# Altium project 404_Senior_Design_Maria.PrjPcb
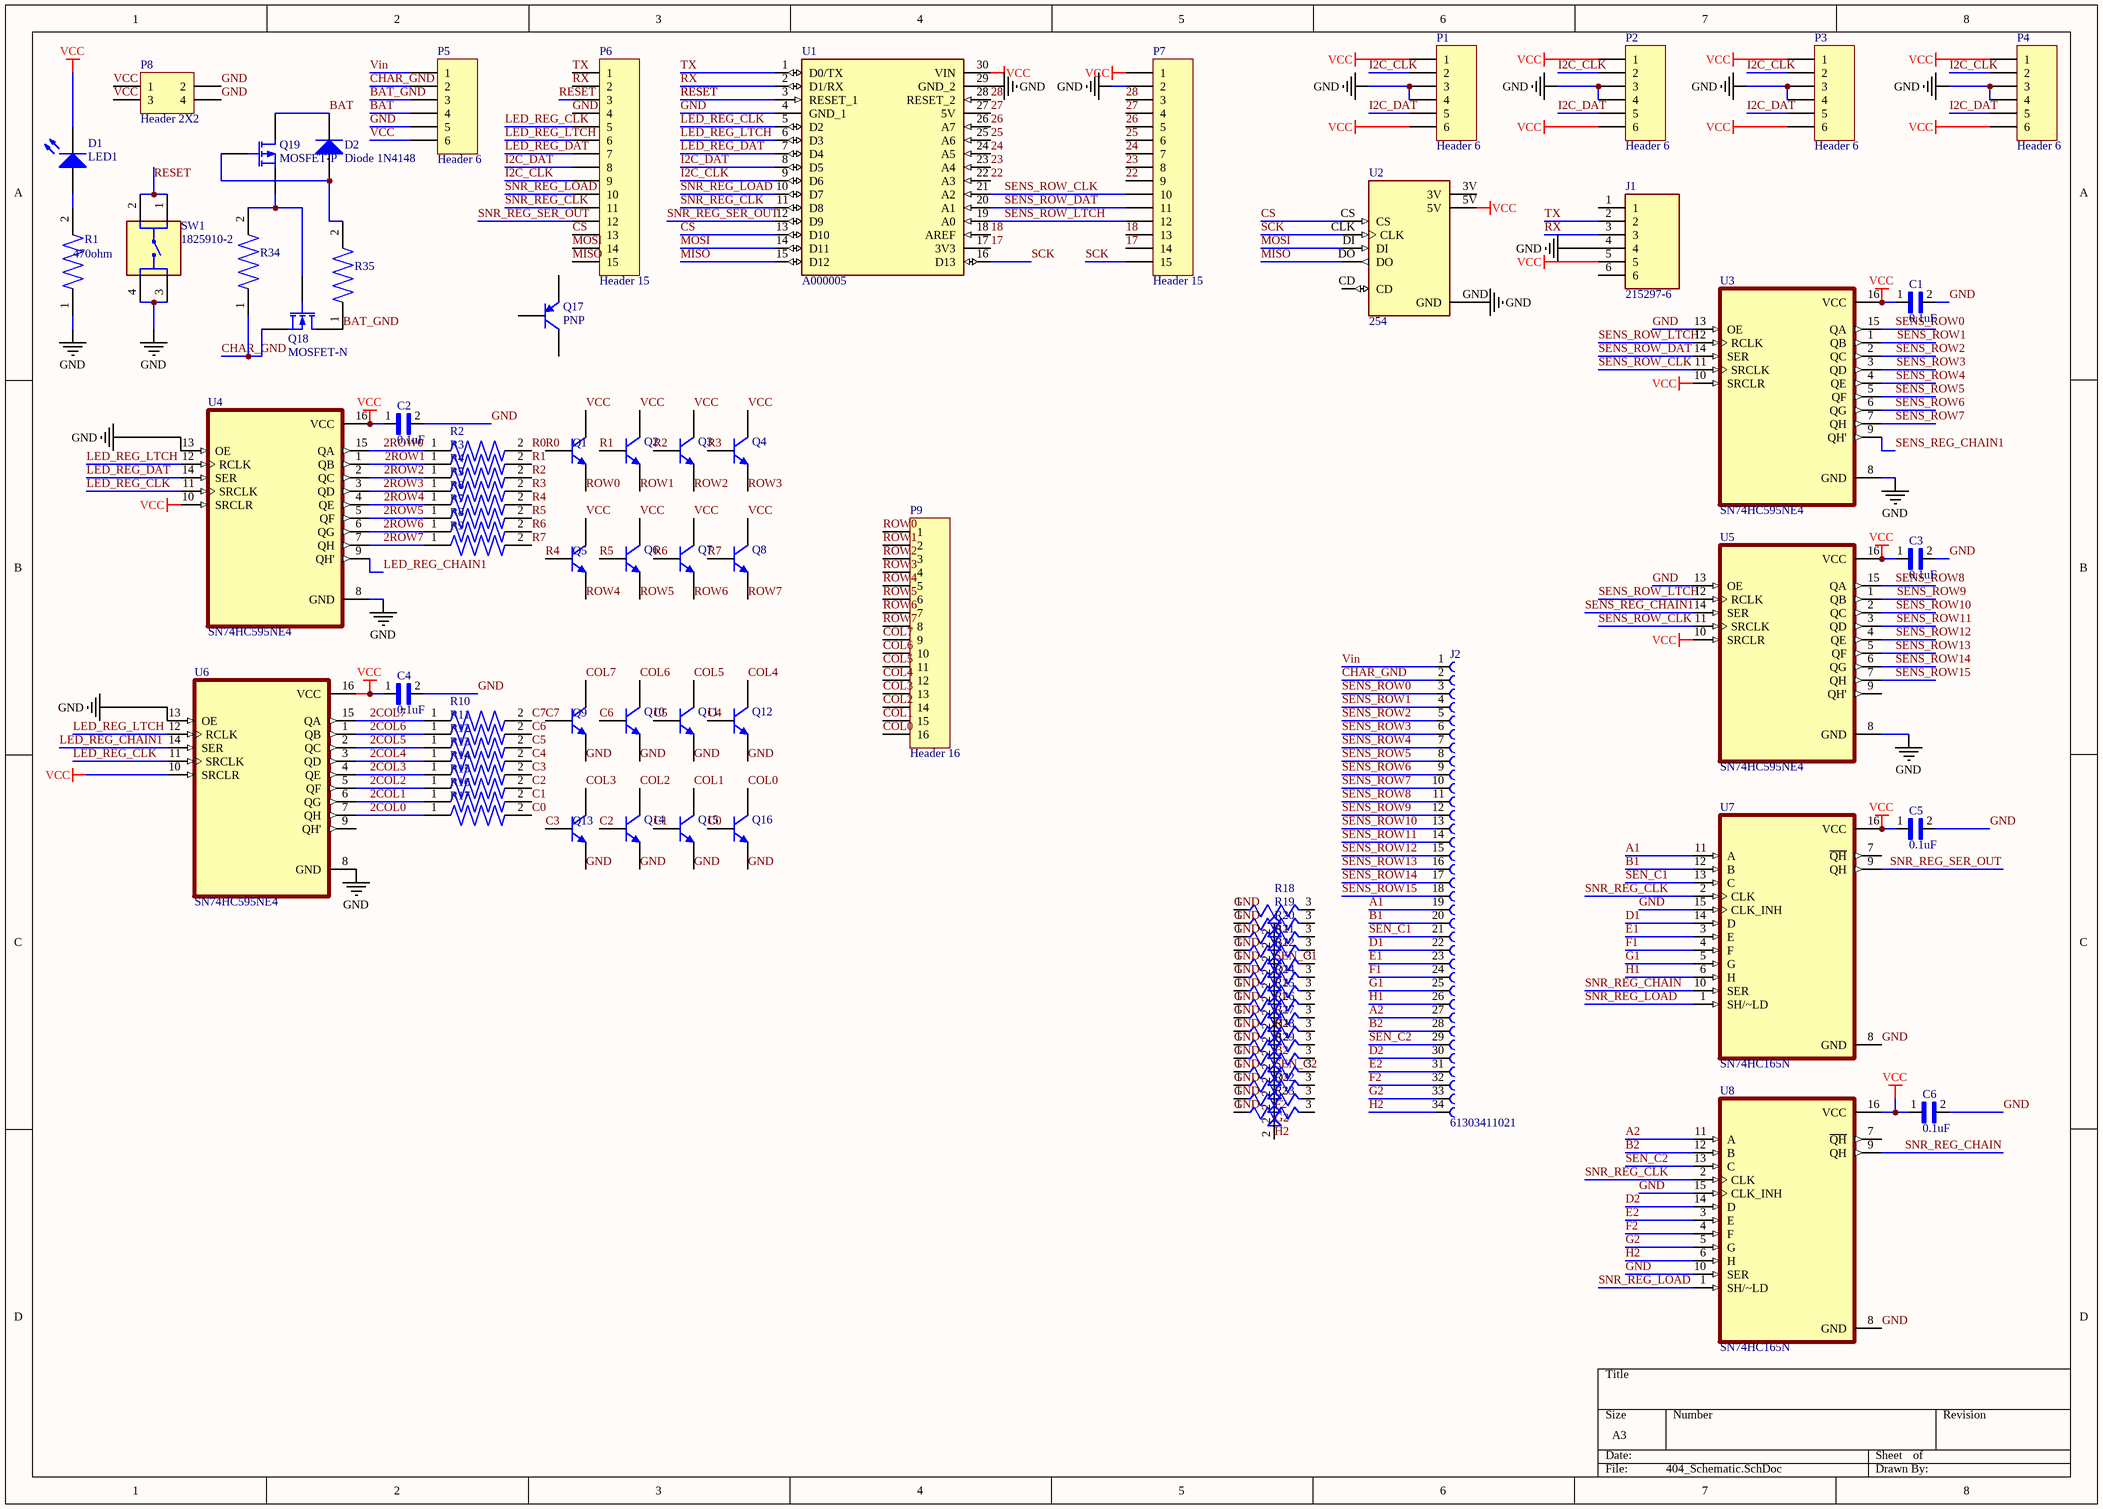
[diagram p0: 404_Schematic.SchDoc]
1 sheet, 82 parts. Net scope: global (net labels, ports and power ports of the same name join across sheets).
Board file: 404_PCB.PcbDoc

## Sheet 404_Schematic.SchDoc
size A3; SheetNumber: 1; SheetTotal: 1

### Parts
C1  0.1uF  [CAP_RDER72H103K1K1H03B]
C2  0.1uF  [CAP_RDER72H103K1K1H03B]
C3  0.1uF  [CAP_RDER72H103K1K1H03B]
C4  0.1uF  [CAP_RDER72H103K1K1H03B]
C5  0.1uF  [CAP_RDER72H103K1K1H03B]
C6  0.1uF  [CAP_RDER72H103K1K1H03B]
D1  LED1  [LED-1]
D2  Diode 1N4148  [DO-35]
J1  215297-6  [TE_215297-6]
J2  61303411021  [61303411021]
P1  Header 6  [HDR1X6]
P2  Header 6  [HDR1X6]
P3  Header 6  [HDR1X6]
P4  Header 6  [HDR1X6]
P5  Header 6  [HDR1X6]
P6  Header 15  [HDR1X15]
P7  Header 15  [HDR1X15]
P8  Header 2X2  [HDR2X2]
P9  Header 16  [HDR1X16]
Q1  2N3904  [TO-92A]  (value not drawn)
Q2  2N3904  [TO-92A]  (value not drawn)
Q3  2N3904  [TO-92A]  (value not drawn)
Q4  2N3904  [TO-92A]  (value not drawn)
Q5  2N3904  [TO-92A]  (value not drawn)
Q6  2N3904  [TO-92A]  (value not drawn)
Q7  2N3904  [TO-92A]  (value not drawn)
Q8  2N3904  [TO-92A]  (value not drawn)
Q9  2N3904  [TO-92A]  (value not drawn)
Q10  2N3904  [TO-92A]  (value not drawn)
Q11  2N3904  [TO-92A]  (value not drawn)
Q12  2N3904  [TO-92A]  (value not drawn)
Q13  2N3904  [TO-92A]  (value not drawn)
Q14  2N3904  [TO-92A]  (value not drawn)
Q15  2N3904  [TO-92A]  (value not drawn)
Q16  2N3904  [TO-92A]  (value not drawn)
Q17  PNP  [SOT-23B_N]
Q18  MOSFET-N  [E3]
Q19  MOSFET-P  [E3]
R1  470ohm  [RESAD700W45L350D185]
R2  390  [RESAD700W45L350D185]  (value not drawn)
R3  390  [RESAD700W45L350D185]  (value not drawn)
R4  390  [RESAD700W45L350D185]  (value not drawn)
R5  (no value)  [RESAD700W45L350D185]
R6  1-1623928-1  [RESAD700W45L350D185]  (value not drawn)
R7  1-1623928-1  [RESAD700W45L350D185]  (value not drawn)
R8  1-1623928-1  [RESAD700W45L350D185]  (value not drawn)
R9  1-1623928-1  [RESAD700W45L350D185]  (value not drawn)
R10  390  [RESAD700W45L350D185]  (value not drawn)
R11  390  [RESAD700W45L350D185]  (value not drawn)
R12  390  [RESAD700W45L350D185]  (value not drawn)
R13  (no value)  [RESAD700W45L350D185]
R14  1-1623928-1  [RESAD700W45L350D185]  (value not drawn)
R15  1-1623928-1  [RESAD700W45L350D185]  (value not drawn)
R16  1-1623928-1  [RESAD700W45L350D185]  (value not drawn)
R17  1-1623928-1  [RESAD700W45L350D185]  (value not drawn)
R18  3352T-1-103LF  [TRIM_3352T-1-103LF]  (value not drawn)
R19  3352T-1-103LF  [TRIM_3352T-1-103LF]  (value not drawn)
R20  3352T-1-103LF  [TRIM_3352T-1-103LF]  (value not drawn)
R21  3352T-1-103LF  [TRIM_3352T-1-103LF]  (value not drawn)
R22  3352T-1-103LF  [TRIM_3352T-1-103LF]  (value not drawn)
R23  3352T-1-103LF  [TRIM_3352T-1-103LF]  (value not drawn)
R24  3352T-1-103LF  [TRIM_3352T-1-103LF]  (value not drawn)
R25  3352T-1-103LF  [TRIM_3352T-1-103LF]  (value not drawn)
R26  3352T-1-103LF  [TRIM_3352T-1-103LF]  (value not drawn)
R27  3352T-1-103LF  [TRIM_3352T-1-103LF]  (value not drawn)
R28  3352T-1-103LF  [TRIM_3352T-1-103LF]  (value not drawn)
R29  3352T-1-103LF  [TRIM_3352T-1-103LF]  (value not drawn)
R30  3352T-1-103LF  [TRIM_3352T-1-103LF]  (value not drawn)
R31  3352T-1-103LF  [TRIM_3352T-1-103LF]  (value not drawn)
R32  3352T-1-103LF  [TRIM_3352T-1-103LF]  (value not drawn)
R33  3352T-1-103LF  [TRIM_3352T-1-103LF]  (value not drawn)
R34  390  [RESAD700W45L350D185]  (value not drawn)
R35  390  [RESAD700W45L350D185]  (value not drawn)
SW1  1825910-2  [TE_1825910-2]
U1  A000005  [MODULE_A000005]
U2  254  [MODULE_254]
U3  SN74HC595NE4  [DIP794W45P254L1969H508Q16]
U4  SN74HC595NE4  [DIP794W45P254L1969H508Q16]
U5  SN74HC595NE4  [DIP794W45P254L1969H508Q16]
U6  SN74HC595NE4  [DIP794W45P254L1969H508Q16]
U7  SN74HC165N  [DIP794W45P254L1969H508Q16]
U8  SN74HC165N  [DIP794W45P254L1969H508Q16]

### Nets
GND: C1.2 C2.2 C3.2 C4.2 C5.2 C6.2 J1.4 P1.3 P1.4 P2.3 P2.4 P3.3 P3.4 P4.3 P4.4 P5.5 P6.4 P7.2 P8.2 P8.4 Q9.1(E) Q10.1(E) Q11.1(E) Q12.1(E) Q13.1(E) Q14.1(E) Q15.1(E) Q16.1(E) R1.1 R18.1(CCW) R19.1(CCW) R20.1(CCW) R21.1(CCW) R22.1(CCW) R23.1(CCW) R24.1(CCW) R25.1(CCW) R26.1(CCW) R27.1(CCW) R28.1(CCW) R29.1(CCW) R30.1(CCW) R31.1(CCW) R32.1(CCW) R33.1(CCW) SW1.3 SW1.4 U1.4(GND_1) U1.29(GND_2) U2.GND U3.8(GND) U3.13(OE) U4.8(GND) U4.13(OE) U5.8(GND) U5.13(OE) U6.8(GND) U6.13(OE) U7.8(GND) U7.15(CLK_INH) U8.8(GND) U8.10(SER) U8.15(CLK_INH)
VCC: C1.1 C2.1 C3.1 C4.1 C5.1 C6.1 D1.2(K) J1.5 P1.1 P1.6 P2.1 P2.6 P3.1 P3.6 P4.1 P4.6 P5.6 P7.1 P8.1 P8.3 Q1.3(C) Q2.3(C) Q3.3(C) Q4.3(C) Q5.3(C) Q6.3(C) Q7.3(C) Q8.3(C) U1.30(VIN) U2.5V U3.10(SRCLR) U3.16(VCC) U4.10(SRCLR) U4.16(VCC) U5.10(SRCLR) U5.16(VCC) U6.10(SRCLR) U6.16(VCC) U7.16(VCC) U8.16(VCC)
2COL0: R17.1 U6.7(QH)
2COL1: R16.1 U6.6(QG)
2COL2: R15.1 U6.5(QF)
2COL3: R14.1 U6.4(QE)
2COL4: R13.1 U6.3(QD)
2COL5: R12.1 U6.2(QC)
2COL6: R11.1 U6.1(QB)
2COL7: R10.1 U6.15(QA)
2ROW0: R2.1 U4.15(QA)
2ROW1: R3.1 U4.1(QB)
2ROW2: R4.1 U4.2(QC)
2ROW3: R5.1 U4.3(QD)
2ROW4: R6.1 U4.4(QE)
2ROW5: R7.1 U4.5(QF)
2ROW6: R8.1 U4.6(QG)
2ROW7: R9.1 U4.7(QH)
17: P7.14 U1.17(3V3)
18: P7.13 U1.18(AREF)
22: P7.9 U1.22(A3)
23: P7.8 U1.23(A4)
24: P7.7 U1.24(A5)
25: P7.6 U1.25(A6)
26: P7.5 U1.26(A7)
27: P7.4 U1.27(5V)
28: P7.3 U1.28(RESET_2)
A1: J2.19 R18.2(WIPER) U7.11(A)
A2: J2.27 R26.2(WIPER) U8.11(A)
B1: J2.20 R19.2(WIPER) U7.12(B)
B2: J2.28 R27.2(WIPER) U8.12(B)
BAT: D2.2(K) P5.4 Q19.1(D)
BAT_GND: P5.3 Q18.1(D) R35.1
C0: Q16.2(B) R17.2
C1: Q15.2(B) R16.2
C2: Q14.2(B) R15.2
C3: Q13.2(B) R14.2
C4: Q12.2(B) R13.2
C5: Q11.2(B) R12.2
C6: Q10.2(B) R11.2
C7: Q9.2(B) R10.2
CHAR_GND: J2.2 P5.2 Q18.3(S) R34.1
COL0: P9.16 Q16.3(C)
COL1: P9.15 Q15.3(C)
COL2: P9.14 Q14.3(C)
COL3: P9.13 Q13.3(C)
COL4: P9.12 Q12.3(C)
COL5: P9.11 Q11.3(C)
COL6: P9.10 Q10.3(C)
COL7: P9.9 Q9.3(C)
CS: P6.13 U1.13(D10) U2.CS
D1: J2.22 R21.2(WIPER) U7.14(D)
D2: J2.30 R29.2(WIPER) U8.14(D)
E1: J2.23 R22.2(WIPER) U7.3(E)
E2: J2.31 R30.2(WIPER) U8.3(E)
F1: J2.24 R23.2(WIPER) U7.4(F)
F2: J2.32 R31.2(WIPER) U8.4(F)
G1: J2.25 R24.2(WIPER) U7.5(G)
G2: J2.33 R32.2(WIPER) U8.5(G)
H1: J2.26 R25.2(WIPER) U7.6(H)
H2: J2.34 R33.2(WIPER) U8.6(H)
I2C_CLK: P1.2 P2.2 P3.2 P4.2 P6.9 U1.9(D6)
I2C_DAT: P1.5 P2.5 P3.5 P4.5 P6.8 U1.8(D5)
LED_REG_CHAIN1: U4.9(QH') U6.14(SER)
LED_REG_CLK: P6.5 U1.5(D2) U4.11(SRCLK) U6.11(SRCLK)
LED_REG_DAT: P6.7 U1.7(D4) U4.14(SER)
LED_REG_LTCH: P6.6 U1.6(D3) U4.12(RCLK) U6.12(RCLK)
MISO: P6.15 U1.15(D12) U2.DO
MOSI: P6.14 U1.14(D11) U2.DI
R0: Q1.2(B) R2.2
R1: Q2.2(B) R3.2
R2: Q3.2(B) R4.2
R3: Q4.2(B) R5.2
R4: Q5.2(B) R6.2
R5: Q6.2(B) R7.2
R6: Q7.2(B) R8.2
R7: Q8.2(B) R9.2
RESET: P6.3 SW1.1 SW1.2 U1.3(RESET_1)
ROW0: P9.1 Q1.1(E)
ROW1: P9.2 Q2.1(E)
ROW2: P9.3 Q3.1(E)
ROW3: P9.4 Q4.1(E)
ROW4: P9.5 Q5.1(E)
ROW5: P9.6 Q6.1(E)
ROW6: P9.7 Q7.1(E)
ROW7: P9.8 Q8.1(E)
RX: J1.3 P6.2 U1.2(D1/RX)
SCK: P7.15 U1.16(D13) U2.CLK
SEN_C1: J2.21 R20.2(WIPER) U7.13(C)
SEN_C2: J2.29 R28.2(WIPER) U8.13(C)
SENS_REG_CHAIN1: U3.9(QH') U5.14(SER)
SENS_ROW0: J2.3 U3.15(QA)
SENS_ROW1: J2.4 U3.1(QB)
SENS_ROW2: J2.5 U3.2(QC)
SENS_ROW3: J2.6 U3.3(QD)
SENS_ROW4: J2.7 U3.4(QE)
SENS_ROW5: J2.8 U3.5(QF)
SENS_ROW6: J2.9 U3.6(QG)
SENS_ROW7: J2.10 U3.7(QH)
SENS_ROW8: J2.11 U5.15(QA)
SENS_ROW9: J2.12 U5.1(QB)
SENS_ROW10: J2.13 U5.2(QC)
SENS_ROW11: J2.14 U5.3(QD)
SENS_ROW12: J2.15 U5.4(QE)
SENS_ROW13: J2.16 U5.5(QF)
SENS_ROW14: J2.17 U5.6(QG)
SENS_ROW15: J2.18 U5.7(QH)
SENS_ROW_CLK: P7.10 U1.21(A2) U3.11(SRCLK) U5.11(SRCLK)
SENS_ROW_DAT: P7.11 U1.20(A1) U3.14(SER)
SENS_ROW_LTCH: P7.12 U1.19(A0) U3.12(RCLK) U5.12(RCLK)
SNR_REG_CHAIN: U7.10(SER) U8.9(QH)
SNR_REG_CLK: P6.11 U1.11(D8) U7.2(CLK) U8.2(CLK)
SNR_REG_LOAD: P6.10 U1.10(D7) U7.1(SH/~LD) U8.1(SH/~LD)
SNR_REG_SER_OUT: P6.12 U1.12(D9) U7.9(QH)
TX: J1.2 P6.1 U1.1(D0/TX)
Vin: J2.1 P5.1
NetD1_1: D1.1(A) R1.2
NetD2_1: D2.1(A) Q19.2(G) R35.2
NetQ18_2: Q18.2(G) Q19.3(S) R34.2

Not connected (* = marked no-connect by the designer): J1 1 6; Q17 1(C) 2(B) 3(E); R18 3(CW); R19 3(CW); R20 3(CW); R21 3(CW); R22 3(CW); R23 3(CW); R24 3(CW); R25 3(CW); R26 3(CW); R27 3(CW); R28 3(CW); R29 3(CW); R30 3(CW); R31 3(CW); R32 3(CW); R33 3(CW); U2 3V CD; U5 9(QH'); U6 9(QH'); U7 7(~{QH}); U8 7(~{QH})

### Library data of the parts
C1-C6 = RDER72H103K1K1H03B: Cap Ceramic 0.0047uF 50V C0G 5% Radial 5mm 125C Bulk; MF: {'manufacturer': u'Murata'}; Package: None; Availability: Unavailable; Value: *; MP: RDER72H103K1K1H03B; Price: None
D1 = LED1: Typical RED GaAs LED; Published: 8-Jun-2000; LatestRevisionDate: 08-Jul-2005; LatestRevisionNote: Mech Layer 1 removed.; PackageReference: LED-1; Publisher: Altium Limited; PackageDescription: LED; 2 Leads
D2 = Diode 1N4148: High Conductance Fast Diode; Published: 8-Jun-2000; LatestRevisionDate: 17-Jul-2002; LatestRevisionNote: Re-released for DXP Platform.; DatasheetVersion: 1997; PackageReference: DO-35; Publisher: Altium Limited; PackageDescription: Diode, Axial; Body 3.8 x 1.9 mm (LxDia. max), Lead Dia. 0.53 mm (max); Code_JEDEC: DO-204-AH; ComponentLink1Description: Manufacturer Link; ComponentLink1URL: http://www.fairchildsemi.com/; ComponentLink2Description: Datasheet; ComponentLink2URL: http://www.fairchildsemi.com/ds/1N%2F1N4148.pdf
J1 = 215297-6: MF: {'manufacturer': u'TE Connectivity'}; Value: *; Availability: Unavailable; Package: None; MP: 215297-6; Price: None
J2 = 61303411021: <b> WR-PHD 2.54mm Angled Pin Header, 34 Pins/<b>=>Con_BTB_PHD_2.54_1_THT_61303411021 <br><a href="http://katalog.we-online.de/media/images/eican/Con_BTB_PHD_2.54_1_THT_61303211021_pf2.jpg" title="Enlarge picture"> <img src="http://katalog.we-online.de/media/thumbs2/eican/thb_Con_BTB_PHD_2.54_1_THT_61303211021_pf2.jpg" width="320"></a><p> Details see: <a href="http://katalog.we-online.de/en/em/613_0xx_110_21">http://katalog.we-online.de/en/em/613_0xx_110_21</a><p> Created 2014-05-29, Karrer Zheng<br> 2014 (C) WÃ¼rth Elektronik; MF: {'manufacturer': u'W\xfcrth Elektronik'}; Value: *; MP: 61303411021; Package: None; Availability: Unavailable; Price: None
P1-P5 = Header 6: Header, 6-Pin; LatestRevisionDate: 17-Jul-2002; LatestRevisionNote: Re-released for DXP Platform.; Publisher: Altium Limited
P6 P7 = Header 15: Header, 15-Pin; LatestRevisionDate: 17-Jul-2002; LatestRevisionNote: Re-released for DXP Platform.; Publisher: Altium Limited
P8 = Header 2X2: Header, 2-Pin, Dual row; LatestRevisionDate: 17-Jul-2002; LatestRevisionNote: Re-released for DXP Platform.; Publisher: Altium Limited
P9 = Header 16: Header, 16-Pin; LatestRevisionDate: 17-Jul-2002; LatestRevisionNote: Re-released for DXP Platform.; Publisher: Altium Limited
Q1-Q16 = 2N3904: NPN General Purpose Amplifier; Published: 8-Jun-2000; LatestRevisionDate: 15-Jan-2003; LatestRevisionNote: PCB Footprint 'BCY-W3/D4.7' replaced; DatasheetVersion: 1997; PackageVersion: Sep-1998; PackageReference: TO-92A; Publisher: Altium Limited; PackageDescription: TO, Flat Index; 3 In-Line, Axial Leads; Body Dia. 4.5mm; Leads 0.51 x 0.48 mm (max); ComponentLink1Description: Manufacturer Link; ComponentLink1URL: http://www.fairchildsemi.com/; ComponentLink2Description: Datasheet; ComponentLink2URL: http://www.fairchildsemi.com/ds/2N%2F2N3904.pdf
Q17 = PNP: PNP Bipolar Transistor; Published: 8-Jun-2000; LatestRevisionDate: 29-May-2009; LatestRevisionNote: IPC-7351 Footprint Added.; PackageVersion: Aug-1999; PackageReference: SOT-23B; Publisher: Altium Limited; PackageDescription: 3-Pin SOT-23 Package 0.95 mm Pitch, 2.4 mm Lead Span
Q18 = MOSFET-N: N-Channel MOSFET; Published: 8-Jun-2000; LatestRevisionDate: 17-Jul-2002; LatestRevisionNote: Re-released for DXP Platform.; PackageVersion: 1995/1996; PackageReference: E3; Publisher: Altium Limited; PackageDescription: TO, Flat Index; 3 In-Line, Axial Leads; Body Dia. 4.6mm; Lead Dia. 0.5 mm (max)
Q19 = MOSFET-P: P-Channel MOSFET; Published: 8-Jun-2000; LatestRevisionDate: 17-Jul-2002; LatestRevisionNote: Re-released for DXP Platform.; PackageVersion: 1995/1996; PackageReference: E3; Publisher: Altium Limited; PackageDescription: TO, Flat Index; 3 In-Line, Axial Leads; Body Dia. 4.6mm; Lead Dia. 0.5 mm (max)
R1 = 2-1623928-5: CFR16 5% 10K 470 ohm; MF: {'manufacturer': u'TE Connectivity'}; Package: None; Availability: Unavailable; Value: *; MP: 2-1623928-5; Price: None
R2-R17 R34 R35 = 1-1623928-1: CFR16 5% 10K; MF: {'manufacturer': u'TE Connectivity'}; Value: *; Availability: Unavailable; Price: None; Package: None; MP: 1-1623928-1
R18-R33 = 3352T-1-103LF: 10 kOhms 0.5W, 1/2W Through Hole Thumbwheel Potentiometer Top Adjustment; MF: {'manufacturer': u'Bourns'}; Value: *; Availability: Unavailable; Price: None; Package: None; MP: 3352T-1-103LF
SW1 = 1825910-2: SWITCH TACTILE SPST-NO 0.05A 24V; MF: {'manufacturer': u'TE Connectivity'}; MP: 1825910-2; Availability: Unavailable; Package: None; Price: None; Value: *
U1 = A000005: CLOCK SAW OSCILLATOR SEAM7050 T&; MF: {'manufacturer': u'Arduino'}; Package: None; MP: A000005; Price: None; Value: *; Availability: Unavailable
U2 = 254: MICROSD CARD BREAKOUT 5V OR 3V; MF: {'manufacturer': u'Adafruit'}; Package: None; MP: 254; Value: *; Price: None; Availability: Unavailable
U3-U6 = SN74HC595NE4: MF: {'manufacturer': u'Texas Instruments'}; Package: None; MP: SN74HC595NE4; Value: *; Price: None; Availability: Unavailable
U7 U8 = SN74HC165N: MF: {'manufacturer': u'Texas Instruments'}; MP: SN74HC165N; Availability: Unavailable; Package: None; Price: None; Value: *